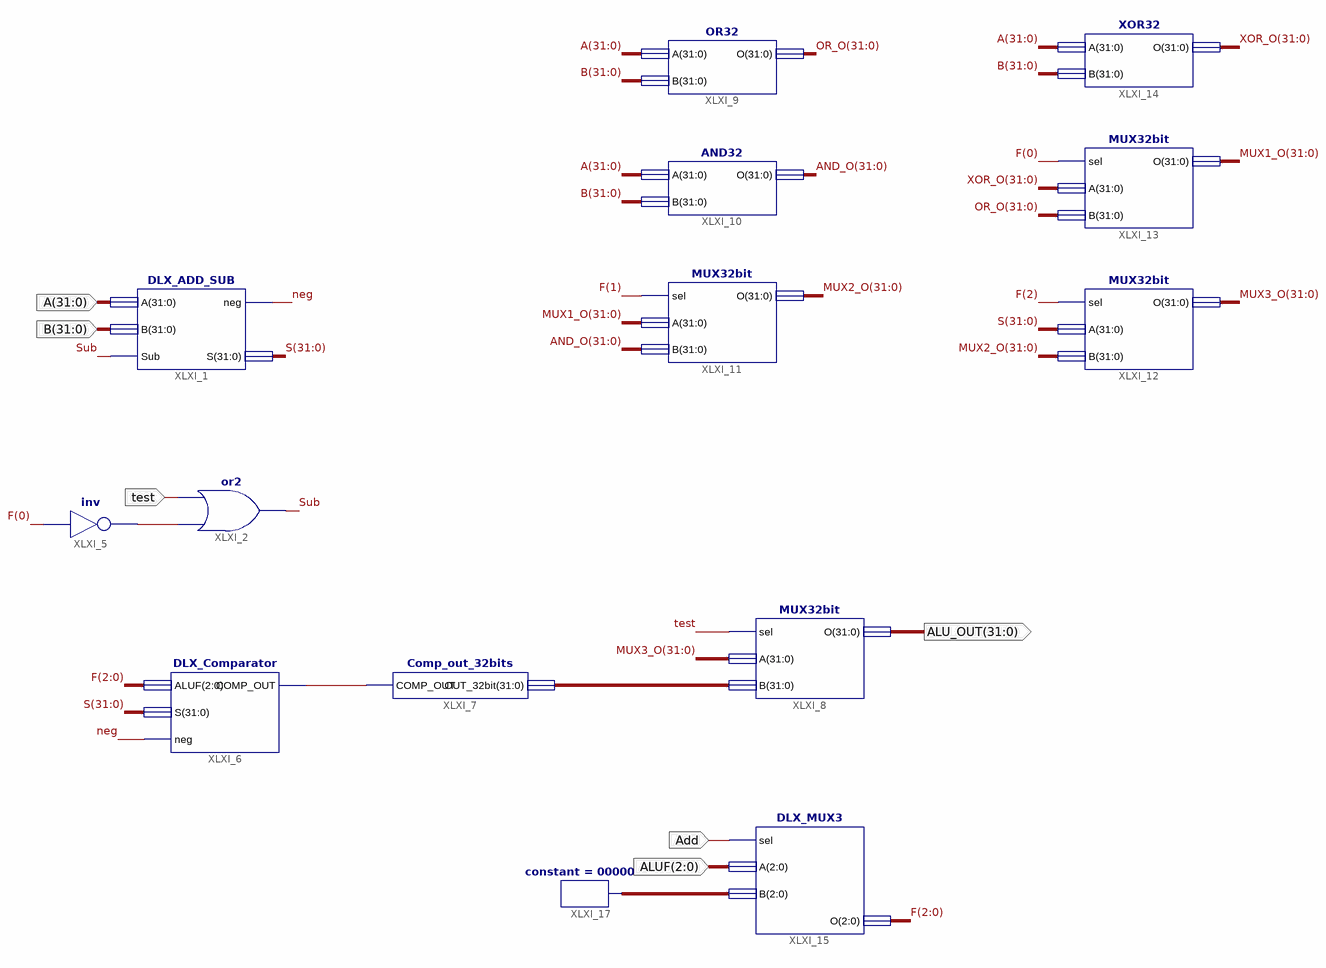
[diagram p0: schematic sheet 1]
// Xilinx ISE schematic DLX_ALU.sch (spartan6) as structural Verilog: 14 symbols, 6 ports
module DLX_ALU (
  input  [31:0] A,
  input  [31:0] B,
  input  test,
  input  Add,
  input  [2:0] ALUF,
  output [31:0] ALU_OUT
);

  wire neg, Sub, XLXN_7, XLXN_10;
  wire [2:0] F, XLXN_43;
  wire [31:0] AND_O, MUX1_O, MUX2_O, MUX3_O, OR_O, S, XLXN_14, XOR_O;

  DLX_ADD_SUB XLXI_1 (.A(A), .B(B), .Sub(Sub), .neg(neg), .S(S));
  or XLXI_2 (Sub, XLXN_7, test);
  not XLXI_5 (XLXN_7, F[0]);
  DLX_Comparator XLXI_6 (.ALUF(F), .S(S), .neg(neg), .COMP_OUT(XLXN_10));
  Comp_out_32bits XLXI_7 (.COMP_OUT(XLXN_10), .OUT_32bit(XLXN_14));
  MUX32bit XLXI_8 (.sel(test), .A(MUX3_O), .B(XLXN_14), .O(ALU_OUT));
  OR32 XLXI_9 (.A(A), .B(B), .O(OR_O));
  AND32 XLXI_10 (.A(A), .B(B), .O(AND_O));
  MUX32bit XLXI_11 (.sel(F[1]), .A(MUX1_O), .B(AND_O), .O(MUX2_O));
  MUX32bit XLXI_12 (.sel(F[2]), .A(S), .B(MUX2_O), .O(MUX3_O));
  MUX32bit XLXI_13 (.sel(F[0]), .A(XOR_O), .B(OR_O), .O(MUX1_O));
  XOR32 XLXI_14 (.A(A), .B(B), .O(XOR_O));
  DLX_MUX3 XLXI_15 (.sel(Add), .A(ALUF), .B(XLXN_43), .O(F));
  constant #(.CValue("00000003")) XLXI_17 (.O(XLXN_43));
endmodule
